# Altium schematic sheet Indicators.SchDoc
size A4
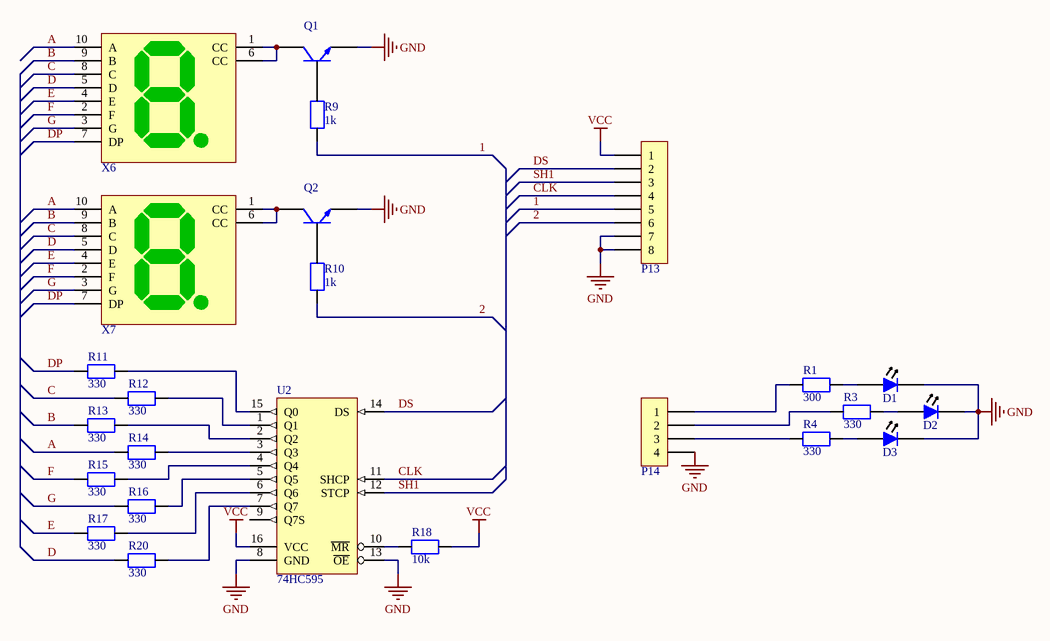
[diagram p0: Indicators.SchDoc]

## Parts
D1  LED  [LED]  (value not drawn)
D2  LED  [LED]  (value not drawn)
D3  LED  [LED]  (value not drawn)
P13  SIL-CONN-8  [SIL-CONN-8-R1]  (value not drawn)
P14  SIL-CONN-4  [SIL-CONN-4-R1]  (value not drawn)
Q1  KT315  [KT315]  (value not drawn)
Q2  KT315  [KT315]  (value not drawn)
R1  value 300  [0805_Resistor]  (hidden comment: Resistor)
R3  value 330  [0805_Resistor]  (hidden comment: Resistor)
R4  value 330  [0805_Resistor]  (hidden comment: Resistor)
R9  value 1k  [0805_Resistor]  (hidden comment: Resistor)
R10  value 1k  [0805_Resistor]  (hidden comment: Resistor)
R11  value 330  [0805_Resistor]  (hidden comment: Resistor)
R12  value 330  [0805_Resistor]  (hidden comment: Resistor)
R13  value 330  [0805_Resistor]  (hidden comment: Resistor)
R14  value 330  [0805_Resistor]  (hidden comment: Resistor)
R15  value 330  [0805_Resistor]  (hidden comment: Resistor)
R16  value 330  [0805_Resistor]  (hidden comment: Resistor)
R17  value 330  [0805_Resistor]  (hidden comment: Resistor)
R18  value 10k  [0805_Resistor]  (hidden comment: Resistor)
R20  value 330  [0805_Resistor]  (hidden comment: Resistor)
U2  74HC595  [SOIC16]
X6  FYS-3912  [FYS-3916]  (value not drawn)
X7  FYS-3912  [FYS-3916]  (value not drawn)

## Nets
GND: D1.K D2.K D3.K P13.7 P13.8 P14.4 Q1.E Q2.E U2.8(GND) U2.13(~{OE})
VCC: P13.1 R18.1 U2.16(VCC)
1: P13.5 R9.1
2: P13.6 R10.1
A: R14.2 X6.10(A) X7.10(A)
B: R13.2 X6.9(B) X7.9(B)
C: R12.2 X6.8(C) X7.8(C)
CLK: P13.4 U2.11(SHCP)
D: R20.2 X6.5(D) X7.5(D)
DP: R11.2 X6.7(DP) X7.7(DP)
DS: P13.2 U2.14(DS)
E: R17.2 X6.4(E) X7.4(E)
F: R15.2 X6.2(F) X7.2(F)
G: R16.2 X6.3(G) X7.3(G)
SH1: P13.3 U2.12(STCP)
NetD1_A: D1.A R1.1
NetD2_A: D2.A R3.1
NetD3_A: D3.A R4.1
NetP14_1: P14.1 R1.2
NetP14_2: P14.2 R3.2
NetP14_3: P14.3 R4.2
NetQ1_B: Q1.B R9.2
NetQ1_K: Q1.K X6.1(CC) X6.6(CC)
NetQ2_B: Q2.B R10.2
NetQ2_K: Q2.K X7.1(CC) X7.6(CC)
NetR11_1: R11.1 U2.15(Q0)
NetR12_1: R12.1 U2.1(Q1)
NetR13_1: R13.1 U2.2(Q2)
NetR14_1: R14.1 U2.3(Q3)
NetR15_1: R15.1 U2.4(Q4)
NetR16_1: R16.1 U2.5(Q5)
NetR17_1: R17.1 U2.6(Q6)
NetR18_2: R18.2 U2.10(~{MR})
NetR20_1: R20.1 U2.7(Q7)

Not connected (* = marked no-connect by the designer): U2 9(Q7S)

## Library data of the parts
Q1 Q2 = KT315: pin to pad: B>3 E>1 K>2